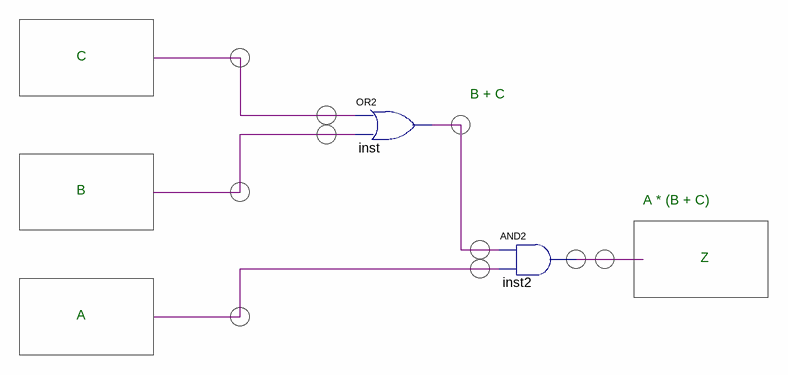
[diagram p0: schematic sheet]
// Quartus schematic ex2.bdf as structural Verilog: 2 symbols, 0 pins
module ex2 (
);

  wire inst2_out, inst_out, undriven, undriven_2, undriven_3;

  or inst (inst_out, undriven_2, undriven);
  and inst2 (inst2_out, inst_out, undriven_3);

  // Notes on the sheet:
  //   C
  //   B + C      
  //   B
  //   A * (B + C)     
  //   Z
  //   A
endmodule
